# Altium schematic sheet Power_Supply.SchDoc: Access Control
size A3; DrawnBy: Q.Thang & T.Khoa; Revision: V1.0.1; SheetNumber: 5; SheetTotal: 16
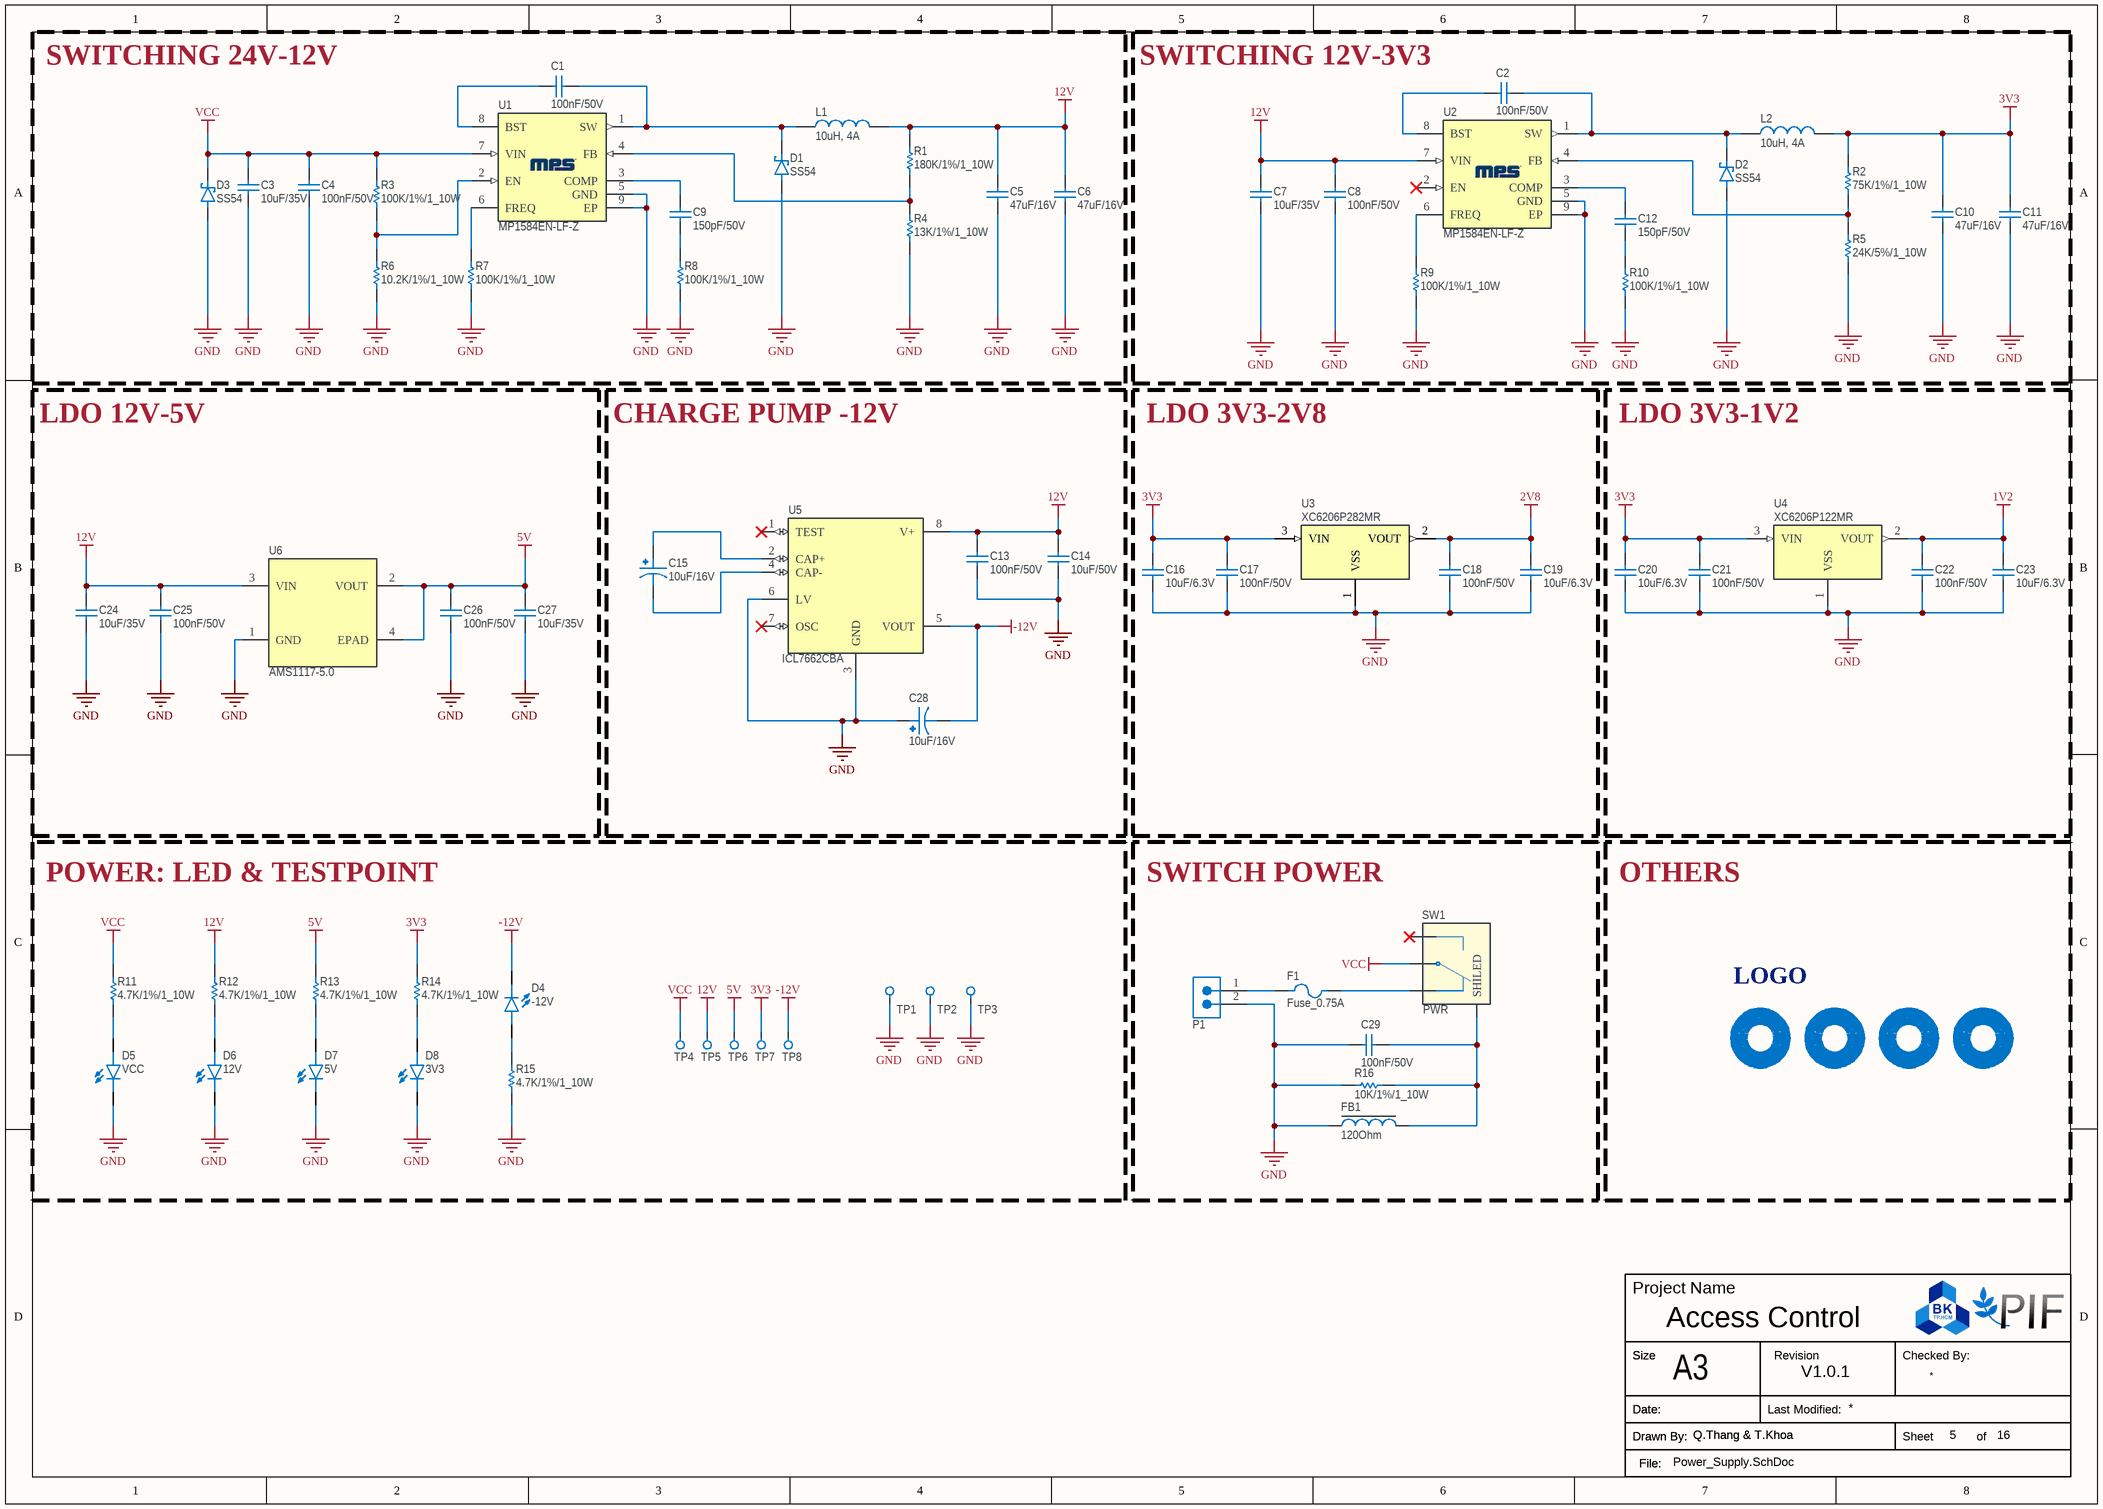
[diagram p0: Power_Supply.SchDoc]

## Parts
*1  LOGO  [BK_LOGO]  (value not drawn)
C1  100nF/50V  [CAP_0603]
C2  100nF/50V  [CAP_0603]
C3  10uF/35V  [CAP_1206]
C4  100nF/50V  [CAP_1206]
C5  47uF/16V  [CAP_1206]
C6  47uF/16V  [CAP_1206]
C7  10uF/35V  [CAP_1206]
C8  100nF/50V  [CAP_1206]
C9  150pF/50V  [CAP_0603]
C10  47uF/16V  [CAP_1206]
C11  47uF/16V  [CAP_1206]
C12  150pF/50V  [CAP_0603]
C13  100nF/50V  [CAP_0805]
C14  10uF/50V  [CAP_0805]
C15  10uF/16V  [TanTa_Cap_A]
C16  10uF/6.3V  [CAP_0603]
C17  100nF/50V  [CAP_0402]
C18  100nF/50V  [CAP_0402]
C19  10uF/6.3V  [CAP_0603]
C20  10uF/6.3V  [CAP_0603]
C21  100nF/50V  [CAP_0402]
C22  100nF/50V  [CAP_0402]
C23  10uF/6.3V  [CAP_0603]
C24  10uF/35V  [CAP_1206]
C25  100nF/50V  [CAP_1206]
C26  100nF/50V  [CAP_1206]
C27  10uF/35V  [CAP_1206]
C28  10uF/16V  [TanTa_Cap_A]
C29  100nF/50V  [CAP_0603]
D1  SS54  [D_SMA]
D2  SS54  [D_SMA]
D3  SS54  [D_SMA]
D4  -12V  [LED_0603Y]
D5  VCC  [LED_0603Y]
D6  12V  [LED_0603Y]
D7  5V  [LED_0603Y]
D8  3V3  [LED_0603Y]
F1  Fuse_0.75A  [FUSER_MF-MSMF075/24-2]
FB1  120Ohm  [Ferrite_Bead_0805]
H1  Mounting Hole without connection  [MountingHole_3.2mm_M3_Pad_Via]  (value not drawn)
H2  Mounting Hole without connection  [MountingHole_3.2mm_M3_Pad_Via]  (value not drawn)
H3  Mounting Hole without connection  [MountingHole_3.2mm_M3_Pad_Via]  (value not drawn)
H4  Mounting Hole without connection  [MountingHole_3.2mm_M3_Pad_Via]  (value not drawn)
L1  10uH, 4A  [Inductor_0630]
L2  10uH, 4A  [Inductor_0630]
P1  5.08mm_2P  [Terminal_Block_5.08mm_2P]  (value not drawn)
R1  180K/1%/1_10W  [Resistor_0603]
R2  75K/1%/1_10W  [Resistor_0603]
R3  100K/1%/1_10W  [Resistor_0603]
R4  13K/1%/1_10W  [Resistor_0603]
R5  24K/5%/1_10W  [Resistor_0603]
R6  10.2K/1%/1_10W  [Resistor_0603]
R7  100K/1%/1_10W  [Resistor_0603]
R8  100K/1%/1_10W  [Resistor_0603]
R9  100K/1%/1_10W  [Resistor_0603]
R10  100K/1%/1_10W  [Resistor_0603]
R11  4.7K/1%/1_10W  [Resistor_0603]
R12  4.7K/1%/1_10W  [Resistor_0603]
R13  4.7K/1%/1_10W  [Resistor_0603]
R14  4.7K/1%/1_10W  [Resistor_0603]
R15  4.7K/1%/1_10W  [Resistor_0603]
R16  10K/1%/1_10W  [Resistor_0603]
SW1  PWR  [MTS-102-C3]
TP1  GND1  [TestPoint_Pad_3.0x3.0mm]  (value not drawn)
TP2  GND2  [TestPoint_Pad_3.0x3.0mm]  (value not drawn)
TP3  GND3  [TestPoint_Pad_3.0x3.0mm]  (value not drawn)
TP4  VCC  [TestPoint_Pad_3.0x3.0mm]  (value not drawn)
TP5  12V  [TestPoint_Pad_3.0x3.0mm]  (value not drawn)
TP6  5V  [TestPoint_Pad_3.0x3.0mm]  (value not drawn)
TP7  3V3  [TestPoint_Pad_3.0x3.0mm]  (value not drawn)
TP8  3V3  [TestPoint_Pad_3.0x3.0mm]  (value not drawn)
U1  MP1584EN-LF-Z  [SOIC-8E]
U2  MP1584EN-LF-Z  [SOIC-8E]
U3  XC6206P282MR  [SOT-23]
U4  XC6206P122MR  [SOT-23]
U5  ICL7662CBA  [SOIC-8]
U6  AMS1117-5.0  [SOT-223]

## Blocks framed on the sheet
SWITCHING 24V-12V: C1 C3-C6 C9 D1 D3 L1 R1 R3 R4 R6-R8 U1
SWITCHING 12V-3V3: C2 C7 C8 C10-C12 D2 L2 R2 R5 R9 R10 U2
LDO 12V-5V: C24-C27 U6
CHARGE PUMP -12V: C13-C15 C28 U5
LDO 3V3-2V8: C16-C19 U3
LDO 3V3-1V2: C20-C23 U4
POWER: LED & TESTPOINT: D4-D8 R11-R15 TP1-TP8
SWITCH POWER: C29 F1 FB1 P1 R16 SW1
OTHERS: *1 H1-H4

## Nets
1V2: C22.2 C23.2 U4.2(VOUT)
2V8: C18.2 C19.2 U3.2(VOUT)
3V3: C10.2 C11.2 C16.2 C17.2 C20.2 C21.2 L2.2 R2.2 R14.2 TP7.1 U3.3(VIN) U4.3(VIN)
5V: C26.2 C27.2 R13.2 TP6.1 U6.2(VOUT) U6.4(EPAD)
12V: C5.2 C6.2 C7.2 C8.2 C13.2 C14.2 C24.2 C25.2 L1.2 R1.2 R12.2 TP5.1 U2.7(VIN) U5.8(V+) U6.3(VIN)
-12V: C28.2 D4.C TP8.1 U5.5(VOUT)
GND: C3.1 C4.1 C5.1 C6.1 C7.1 C8.1 C10.1 C11.1 C13.1 C14.1 C16.1 C17.1 C18.1 C19.1 C20.1 C21.1 C22.1 C23.1 C24.1 C25.1 C26.1 C27.1 C28.1 C29.1 D1.2(A) D2.2(A) D3.2(A) D5.C D6.C D7.C D8.C FB1.2 P1.2 R4.1 R5.1 R6.1 R7.1 R8.1 R9.1 R10.1 R15.2 R16.1 TP1.1 TP2.1 TP3.1 U1.5(GND) U1.9(EP) U2.5(GND) U2.9(EP) U3.1(VSS) U4.1(VSS) U5.3(GND) U5.6(LV) U6.1(GND)
VCC: C3.2 C4.2 D3.1(C) R3.2 R11.2 SW1.2 TP4.1 U1.7(VIN)
NetC1_1: C1.1 U1.8(BST)
NetC1_2: C1.2 D1.1(C) L1.1 U1.1(SW)
NetC2_1: C2.1 U2.8(BST)
NetC2_2: C2.2 D2.1(C) L2.1 U2.1(SW)
NetC9_1: C9.1 R8.2
NetC9_2: C9.2 U1.3(COMP)
NetC12_1: C12.1 R10.2
NetC12_2: C12.2 U2.3(COMP)
NetC15_1: C15.1 U5.2(CAP+)
NetC15_2: C15.2 U5.4(CAP-)
NetC29_2: C29.2 FB1.1 R16.2 SW1.SH(SHILED)
NetD4_A: D4.A R15.1
NetD5_A: D5.A R11.1
NetD6_A: D6.A R12.1
NetD7_A: D7.A R13.1
NetD8_A: D8.A R14.1
NetF1_1: F1.1 P1.1
NetF1_2: F1.2 SW1.1
NetR1_1: R1.1 R4.2 U1.4(FB)
NetR2_1: R2.1 R5.2 U2.4(FB)
NetR3_1: R3.1 R6.2 U1.2(EN)
NetR7_2: R7.2 U1.6(FREQ)
NetR9_2: R9.2 U2.6(FREQ)

Not connected (* = marked no-connect by the designer): SW1 3*; U2 2(EN)*; U5 1(TEST)* 7(OSC)*

## Notes on the sheet
- Project Name
- Size
- A3
- Revision
- Checked By:
- Drawn By:
- Date:
- File:
- Last Modified:
- Sheet
- of

## Library data of the parts
C1 C2 C29 = Ceramic_Cap_100nF_50V_0603: CAP, size 0603, 100nF, 50V; Supply Part Number: Tụ Gốm 0603 100nF (0.1uF) 50V; Supply Name: Thegioiic; Datasheet: *; Supply URL: https://www.thegioiic.com/tu-gom-0603-100nf-0-1uf-50v
C3 C7 C24 C27 = Ceramic_Cap_10uF_35V_1206: CAP, size 1206, 10uF, 35V; Supply Part Number: Tụ Gốm 1206 10uF 35V; Supply Name: Thegioiic; Datasheet: *; Supply URL: https://www.thegioiic.com/tu-gom-1206-10uf-35v
C4 C8 C25 C26 = Ceramic_Cap_100nF_50V_1206: CAP, size 1206, 100nF, 50V; Supply Part Number: Tụ Gốm 1206 100nF (0.1uF) 50V; Supply Name: Thegioiic; Datasheet: *; Supply URL: https://www.thegioiic.com/tu-gom-1206-100nf-0-1uf-50v
C5 C6 C10 C11 = Ceramic_Cap_47uF_16V_1206: CAP, size 1206, 47uF, 16V; Supply Part Number: Tụ Gốm 1206 47uF 16V; Supply Name: Thegioiic; Datasheet: *; Supply URL: https://www.thegioiic.com/tu-gom-1206-47uf-16v
C9 C12 = Ceramic_Cap_150pF_50V_0603: CAP, size 0603, 150pF, 50V; Supply Part Number: Tụ Gốm 0603 150pF 50V; Supply Name: Thegioiic; Datasheet: *; Supply URL: https://www.thegioiic.com/tu-gom-0603-150pf-50v
C13 = Ceramic_Cap_100nF_50V_0805: CAP, size 0805, 100nF, 50V; Supply Part Number: Tụ Gốm 0805 100nF (0.1uF) 50V; Supply Name: Thegioiic; Datasheet: *; Supply URL: https://www.thegioiic.com/tu-gom-0805-100nf-0-1uf-50v
C14 = Ceramic_Cap_10uF_50V_0805: CAP, size 0805, 10uF, 50V; Supply Part Number: Tụ Gốm 0805 10uF 50V; Supply Name: Thegioiic; Datasheet: *; Supply URL: https://www.thegioiic.com/tu-gom-0805-10uf-50v
C15 C28 = Tanta_Cap_10uF_16V_1206: Tantalum Capacitors 10uF 16V 1206; Supply Part Number: AVX; Supply Name: 1206 AVX
C16 C19 C20 C23 = Ceramic_Cap_10uF_6.3V_0603: CAP, size 0603, 10uF, 6.3V; Supply Part Number: CC0603KRX5R5BB106; Supply Name: tme; Datasheet: *; Supply URL: http://www.tme.vn/Product.aspx?id=1165#page=pro_info
C17 C18 C21 C22 = Ceramic_Cap_100nF_50V_0402: CAP, size 0402, 100nF, 50V; Supply Part Number: Tụ Gốm 0402 100nF (0.1uF) 50V; Supply Name: Thegioiic; Datasheet: *; Supply URL: https://www.thegioiic.com/tu-gom-0402-100nf-0-1uf-50v
D1-D3 = Diode_SS54: Diode Schottky 40V 5A Surface Mount SMA; Supply Part Number: SS54 SMA Diode Shotky 5A 40V; Supply Name: Thegioiic; Datasheet: https://www.thegioiic.com/upload/documents/dc8a63b3eda4738bc390d9dc570a4e18.pdf; Supply URL: https://www.thegioiic.com/ss54-sma-diode-shotky-5a-40v
D4-D8 = LED_Yellow_0603: LED Yellow 0603; Supply Part Number: LED Vàng 0603 Dán SMD Trong Suốt Harvatek; Supply Name: Thegioiic; Supply URL: https://www.thegioiic.com/led-vang-0603-dan-smd-trong-suot-harvatek
F1 = Fuse_24V_0.75A_1812: MF-MSMF075/24-2 Cầu Chì Tự Phục Hồi 1812 24V 0.75A; Supply Name: Thegioiic; Datasheet: https://www.bourns.com/docs/product-datasheets/mf-msmf.pdf?sfvrsn=4a75e5c0_64; Supply Part Number: MF-MSMF075/24-2 Cầu Chì Tự Phục Hồi 1812 24V 0.75A; Supply URL: https://www.thegioiic.com/mf-msmf075-24-2-cau-chi-tu-phuc-hoi-1812-24v-0-75a
FB1 = Ferrite_Bead_120Ohm_2A_0805: Ferrite Bead, size 0805, 120Ohm, 2A; Supply Part Number: CBW201209U121T Ferrite Beads 2A 120 Ohm 0805; Supply Name: Thegioiic; Supply URL: https://www.thegioiic.com/cbw201209u121t-ferrite-beads-2a-120-ohm-0805
H1-H4 = MountingHole: Datasheet: *; Supply Name: *; Supply Part Number: *; Supply URL: *
L1 L2 = IND_10uH_0630: 10uH, 4A, Size 0630; Supply Part Number: Cuộn cảm 10UH 0630; Supply Name: icdayroi; Supply URL: https://icdayroi.com/cuon-cam-10uh-0630
P1 = Terminal_Block_5.08mm_2P: Terminal Block THT, pitch 5.08mm, 2p, 300V, 10A; Supply Part Number: UL-5.08-2-R Terminal Block Plug-in Hàn PCB 2 Chân Cong 5.08mm 300V 15A ULO; Supply Name: Thegioiic; Supply URL: https://www.thegioiic.com/ul-5-08-2-r-terminal-block-plug-in-han-pcb-2-chan-cong-5-08mm-300v-15a-ulo
R1 = Res_180K_0603_1%: Resistor 0603 180KOhm 1% 1_10W; Supply Part Number: Điện Trở 180 KOhm 0603 1%; Supply Name: Thegioiic; Supply URL: https://www.thegioiic.com/dien-tro-180-kohm-0603-1-
R2 = Res_75K_0603_1%: Resistor 0603 75KOhm 1% 1_10W; Supply Part Number: Điện Trở 75 KOhm 0603 1%; Supply Name: Thegioiic; Supply URL: https://www.thegioiic.com/dien-tro-75-kohm-0603-1-
R3 R7-R10 = Res_100K_0603_1%: Resistor 0603 100KOhm 1% 1_10W; Supply Part Number: Điện Trở 100 KOhm 0603 1%; Supply Name: Thegioiic; Supply URL: https://www.thegioiic.com/dien-tro-100-kohm-0603-1-
R4 = Res_13K_0603_1%: Resistor 0603 13KOhm 1% 1_10W; Supply Part Number: Điện Trở 13 KOhm 0603 1%; Supply Name: Thegioiic; Supply URL: https://www.thegioiic.com/dien-tro-13-kohm-0603-1-
R5 = Res_24K_0603_5%: Resistor 0603 24KOhm 5% 1_10W; Supply Part Number: Điện Trở 24 KOhm 0603 5%; Supply Name: Thegioiic; Supply URL: https://www.thegioiic.com/dien-tro-24-kohm-0603-5-
R6 = Res_10.2K_0603_1%: Resistor 0603 10.2KOhm 1% 1_10W; Supply Part Number: Điện Trở 10.2 KOhm 0603 1%; Supply Name: Thegioiic; Supply URL: https://www.thegioiic.com/dien-tro-10-2-kohm-0603-1-
R11-R15 = Res_4.7K_0603_1%: Resistor 0603 4.7KOhm 1% 1_10W; Supply Part Number: Điện Trở 4.7 KOhm 0603 1%; Supply Name: Thegioiic; Supply URL: https://www.thegioiic.com/dien-tro-4-7-kohm-0603-1-
R16 = Res_10K_0603_1%: Resistor 0603 10KOhm 1% 1_10W; Supply Part Number: Điện Trở 10 KOhm 0603 1%; Supply Name: Thegioiic; Supply URL: https://www.thegioiic.com/dien-tro-10-kohm-0603-1-
SW1 = MTS-102-C3: Switch Toggle; Supply Part Number: MTS-102-C3 Công Tắc Toggle ON-ON Gạt Giữ 3 Chân Cong 6A 125VAC; Supply Name: Thegioiic; Datasheet: *; Supply URL: https://www.thegioiic.com/mts-102-c3-cong-tac-toggle-on-on-gat-giu-3-chan-cong-6a-125vac
TP1-TP8 = Testpoint_SMD: Datasheet: *; Supply Name: *; Supply Part Number: *; Supply URL: *
U1 U2 = MP1584EN-LF-Z: Buck Switching Regulator IC Positive Adjustable 0.8V 1 Output 3A 8-SOIC _0.154, 3.90mm Width_ Exposed Pad; Supply Name: tme; Datasheet: https://www.monolithicpower.com/en/documentview/productdocument/index/version/2/document_type/Datasheet/lang/en/sku/MP1584EN-LF-Z/document_id/204/?srsltid=AfmBOopCyUDyOs-uLll4YtNPir4o4STehG4B04EkgGGTflYW96m-OPS4; Supply Part Number: MP1584EN-LF-Z; Supply URL: http://www.tme.vn/Product.aspx?id=2070#page=pro_info
U3 = XC6206P282MR: LDO Regulator IC 2.8V; Supply Part Number: IC nguồn XC6206P282MR XC6206-2.8V SOT-23; Supply Name: LinhKienThuDuc; Datasheet: https://product.torexsemi.com/system/files/series/xc6206.pdf; Supply URL: https://linhkienthuduc.com/san-pham/ic-nguon-xc6206p282mr-xc6206-2-8v-sot-23/?srsltid=AfmBOoqd3LZKboXW9OfwVV72Gfw02pCDNwWKEzmEXcFyHjhIUeewssqN
U4 = XC6206P122MR: LDO Regulator IC 1.2V; Supply Part Number: IC nguồn XC6206P122MR XC6206-1.2V SOT-23; Supply Name: LinhKienThuDuc; Datasheet: https://product.torexsemi.com/system/files/series/xc6206.pdf; Supply URL: https://linhkienthuduc.com/san-pham/ic-nguon-xc6206p122mr-xc6206-1-2v-sot-23/?srsltid=AfmBOoqZu0g7j9WGKrjDl4O5a-JCOUfPSMG8bfJmSCZku9rh09-J63is
U5 = ICL7662CBA: Vin: 4.5V ~ 20V, Vout: -Vin, 8-SOIC; Supply Part Number: IC Dán ICL7662; Supply Name: Chipn24; Datasheet: https://www.analog.com/media/en/technical-documentation/data-sheets/icl7662-si7661.pdf; Supply URL: https://chipn24.com/sop-ic-dan-icl7662-sop-8-smd-icl7662cba-id9015.html
U6 = AMS1117-5.0: 5.0V 1A Low dropout (LDO) Voltage Regulator; Supply Name: tme; Datasheet: http://www.advanced-monolithic.com/pdf/ds1117.pdf; Supply Part Number: AMS1117-5.0; Supply URL: http://tme.vn/Product.aspx?id=437#page=pro_info